# EAGLE design caphumidsens_rev1 (EAGLE 6.3)
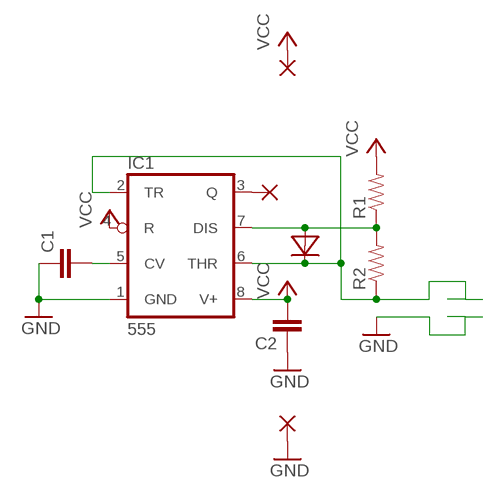
[diagram p0: schematic, sheet 1]

## Parts
C1  CAP0805  [0805]
C2  CAP0805  [0805]
D1  DIODE_0805  [DIODE_0805]
GND  WIREPADSMD2,54-5,08  [SMD2,54-5,08]
IC1  555  NE555D  [SO08]
OUT  WIREPADSMD2,54-5,08  [SMD2,54-5,08]
R1  RESISTOR0805-RES  [0805]
R2  RESISTOR0805-RES  [0805]
VCC  WIREPADSMD2,54-5,08  [SMD2,54-5,08]

## Nets
CAP+: D1.1(C) IC1.2(TR) IC1.6(THR) R2.1
GND: C1.1 C2.1 GND.1(P) IC1.1(GND)
N$1: D1.2(A) IC1.7(DIS) R1.1 R2.2
N$3: C1.2 IC1.5(CV)
N$4: IC1.3(Q) OUT.1(P)
VCC: C2.2 IC1.4(R) IC1.8(V+) R1.2 VCC.1(P)

## Library data of the parts
C1 C2 = SparkFun:CAP: Capacitor Standard 0603 ceramic capacitor, and 0.1" leaded capacitor.
D1 = seb:DIODE_0805
GND OUT VCC = wirepad:WIREPAD: Wire PAD connect wire on PCB
IC1 = linear:*555: TIMER
R1 R2 = SparkFun:RESISTOR: Resistor Basic schematic elements and footprints for 0603, 1206, and PTH resistors.

## Board
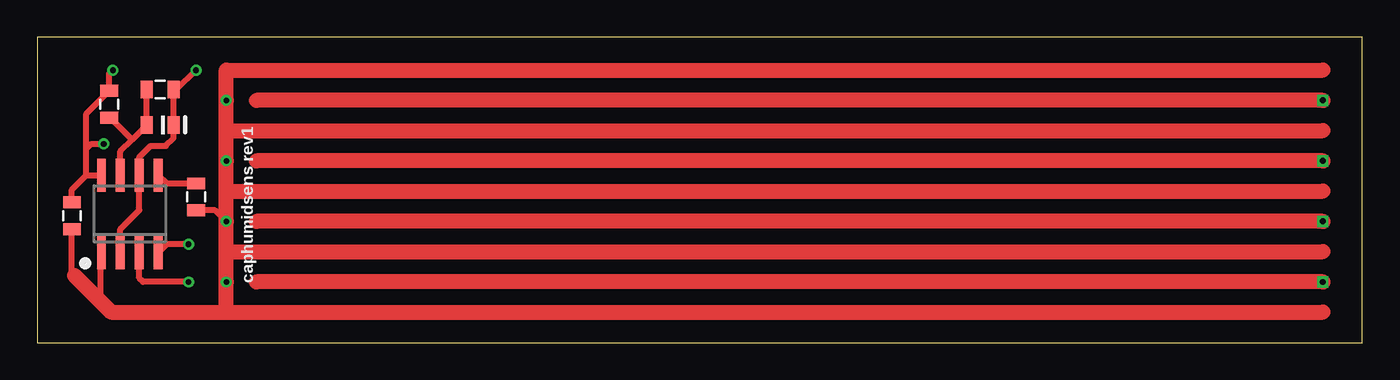
[diagram p1: board, top side]
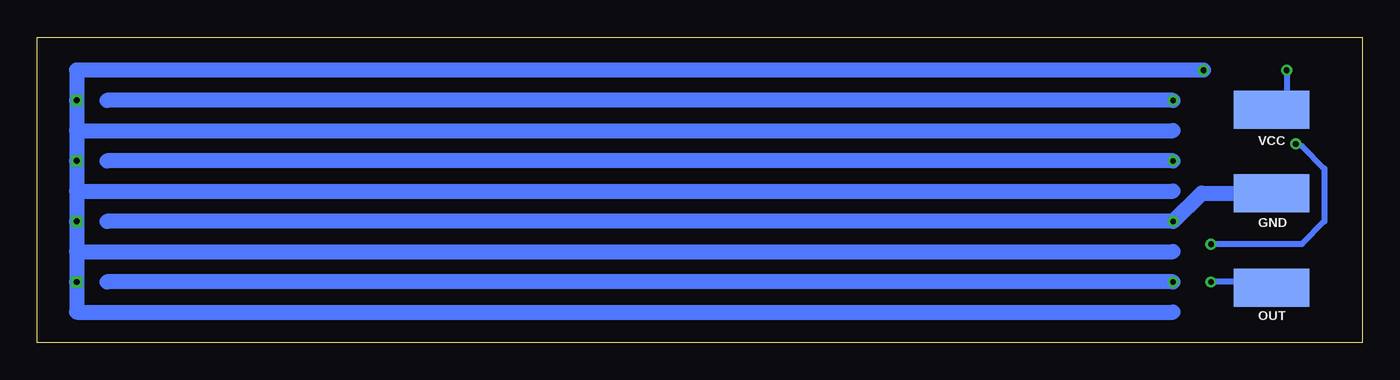
[diagram p2: board, bottom side, seen from below]

Size 89.01 x 20.5 mm. Coordinates in mm from the lower left corner, seen from the top.
Outline: 0,0 89.01,0 89.01,20.5 0,20.5 0,0
Copper layers (1*16): Top 0.0356mm / dielectric 1.5011mm / Bottom 0.0356mm
Design rules "LaenPCBOrder": minimum track width 6mil, minimum drill 13mil, track to track 6mil, track to pad 6mil, pad to pad 6mil, via to via 6mil, smd to smd 6mil, copper to edge 15mil, drill to drill 6mil, minimum pad ring 7mil, minimum via ring 7mil, stop-mask expansion 4mil, vias tented up to drill 0mil, thermal gap 10mil

### Footprints (pad centres in the part's own frame; a part is rotated, then mirrored left to right if it is on the bottom)
0805 = smd 0.8 x 1.2: 1 -0.9,0; 2 0.9,0
DIODE_0805 = smd 0.8 x 1.2: 1 -0.9,0; 2 0.9,0
SMD2,54-5,08 = smd 2.54 x 5.08: 1 0,0
SO08 = smd 0.6 x 2.2: 1 -1.905,-2.6; 2 -0.635,-2.6; 3 0.635,-2.6; 4 1.905,-2.6; 5 1.905,2.6; 6 0.635,2.6; 7 -0.635,2.6; 8 -1.905,2.6

### Placement (x,y rotation side)
C1  10.67,9.78 90 top
C2  2.33,8.51 90 top
D1  8.26,14.61 180 top
GND  6.1,10.03 90 bottom
IC1  6.22,8.64 0 top
OUT  6.1,3.68 90 bottom
R1  4.83,16 90 top
R2  8.26,16.99 180 top
VCC  6.1,15.62 90 bottom

### Tracks (layer width: path | path; a pad name or v marks a point on that pad's centre or on a via)
CAP+  (via drill 0.38 pad 0.41, 0.4)
  Top 0.406: v10.67,18.29 9.37,16.99 R2.1 D1.1 9.15,13.73 8.64,13.21 7.62,13.21 6.86,12.45 IC1.6 6.86,8.89 5.59,7.62 IC1.2
  Top 1.016: v86.36,16.26 14.73,16.26 | v86.36,12.19 14.73,12.19 | v86.36,8.13 14.73,8.13 | v86.36,4.06 14.73,4.06
  Bottom 1.016: v10.67,18.29 86.36,18.29 v86.36,16.26 86.36,14.22 | 86.36,14.22 v86.36,12.19 86.36,10.16 | 86.36,10.16 v86.36,8.13 86.36,6.1 | 86.36,6.1 v86.36,4.06 86.36,2.03 12.7,2.03 | 86.36,14.22 12.7,14.22 | 86.36,10.16 12.7,10.16 | 86.36,6.1 12.7,6.1
GND  (via drill 0.38 pad 0.41)
  Top 0.406: IC1.1 4.26,6.1 4.26,3 4,3 | C1.1 11.95,8.88 v12.7,8.13 | 2.5,4.5 2.33,4.67 C2.1
  Top 1.016: 12.7,2.03 v12.7,4.06 12.7,6.1 | 12.7,6.1 v12.7,8.13 12.7,10.16 | 12.7,10.16 v12.7,12.19 12.7,14.22 | 12.7,14.22 v12.7,16.26 12.7,18.29 86.36,18.29 | 12.7,14.22 86.36,14.22 | 12.7,10.16 86.36,10.16 | 12.7,6.1 86.36,6.1 | 12.7,2.03 86.36,2.03 | 12.7,2.03 4.97,2.03 4,3 2.5,4.5
  Bottom 1.016: v12.7,16.26 84.33,16.26 | v12.7,12.19 84.33,12.19 | 84.33,8.13 v12.7,8.13 10.79,10.03 GND.1 | v12.7,4.06 84.33,4.06
N$1
  Top 0.406: IC1.7 5.59,12.84 6.38,13.62 | 6.38,13.62 D1.2 R2.2 7.36,16.9 | R1.1 4.9,15.1 6.38,13.62
N$3
  Top 0.406: C1.2 8.69,10.68 IC1.5
N$4  (via drill 0.38 pad 0.41)
  Top 0.406: IC1.3 6.86,4.32 7.11,4.06 v10.16,4.06
  Bottom 0.406: v10.16,4.06 6.48,4.06 OUT.1
VCC  (via drill 0.38 pad 0.41)
  Top 0.406: 3.3,11.24 IC1.8 | C2.2 2.33,10.27 3.3,11.24 | v10.16,6.6 8.7,6.6 IC1.4 | 3.3,11.24 3.3,13 | 3.3,13 3.3,15.38 R1.2 4.83,18.03 v5.08,18.29 | v4.47,13.34 3.64,13.34 3.3,13
  Bottom 0.406: 5.97,15.75 VCC.1 5.08,16.64 v5.08,18.29 | v10.16,6.6 4.06,6.6 2.54,8.13 2.54,11.68 4.06,13.21 v4.47,13.34

### Text on the board
tNames: caphumidsens rev1